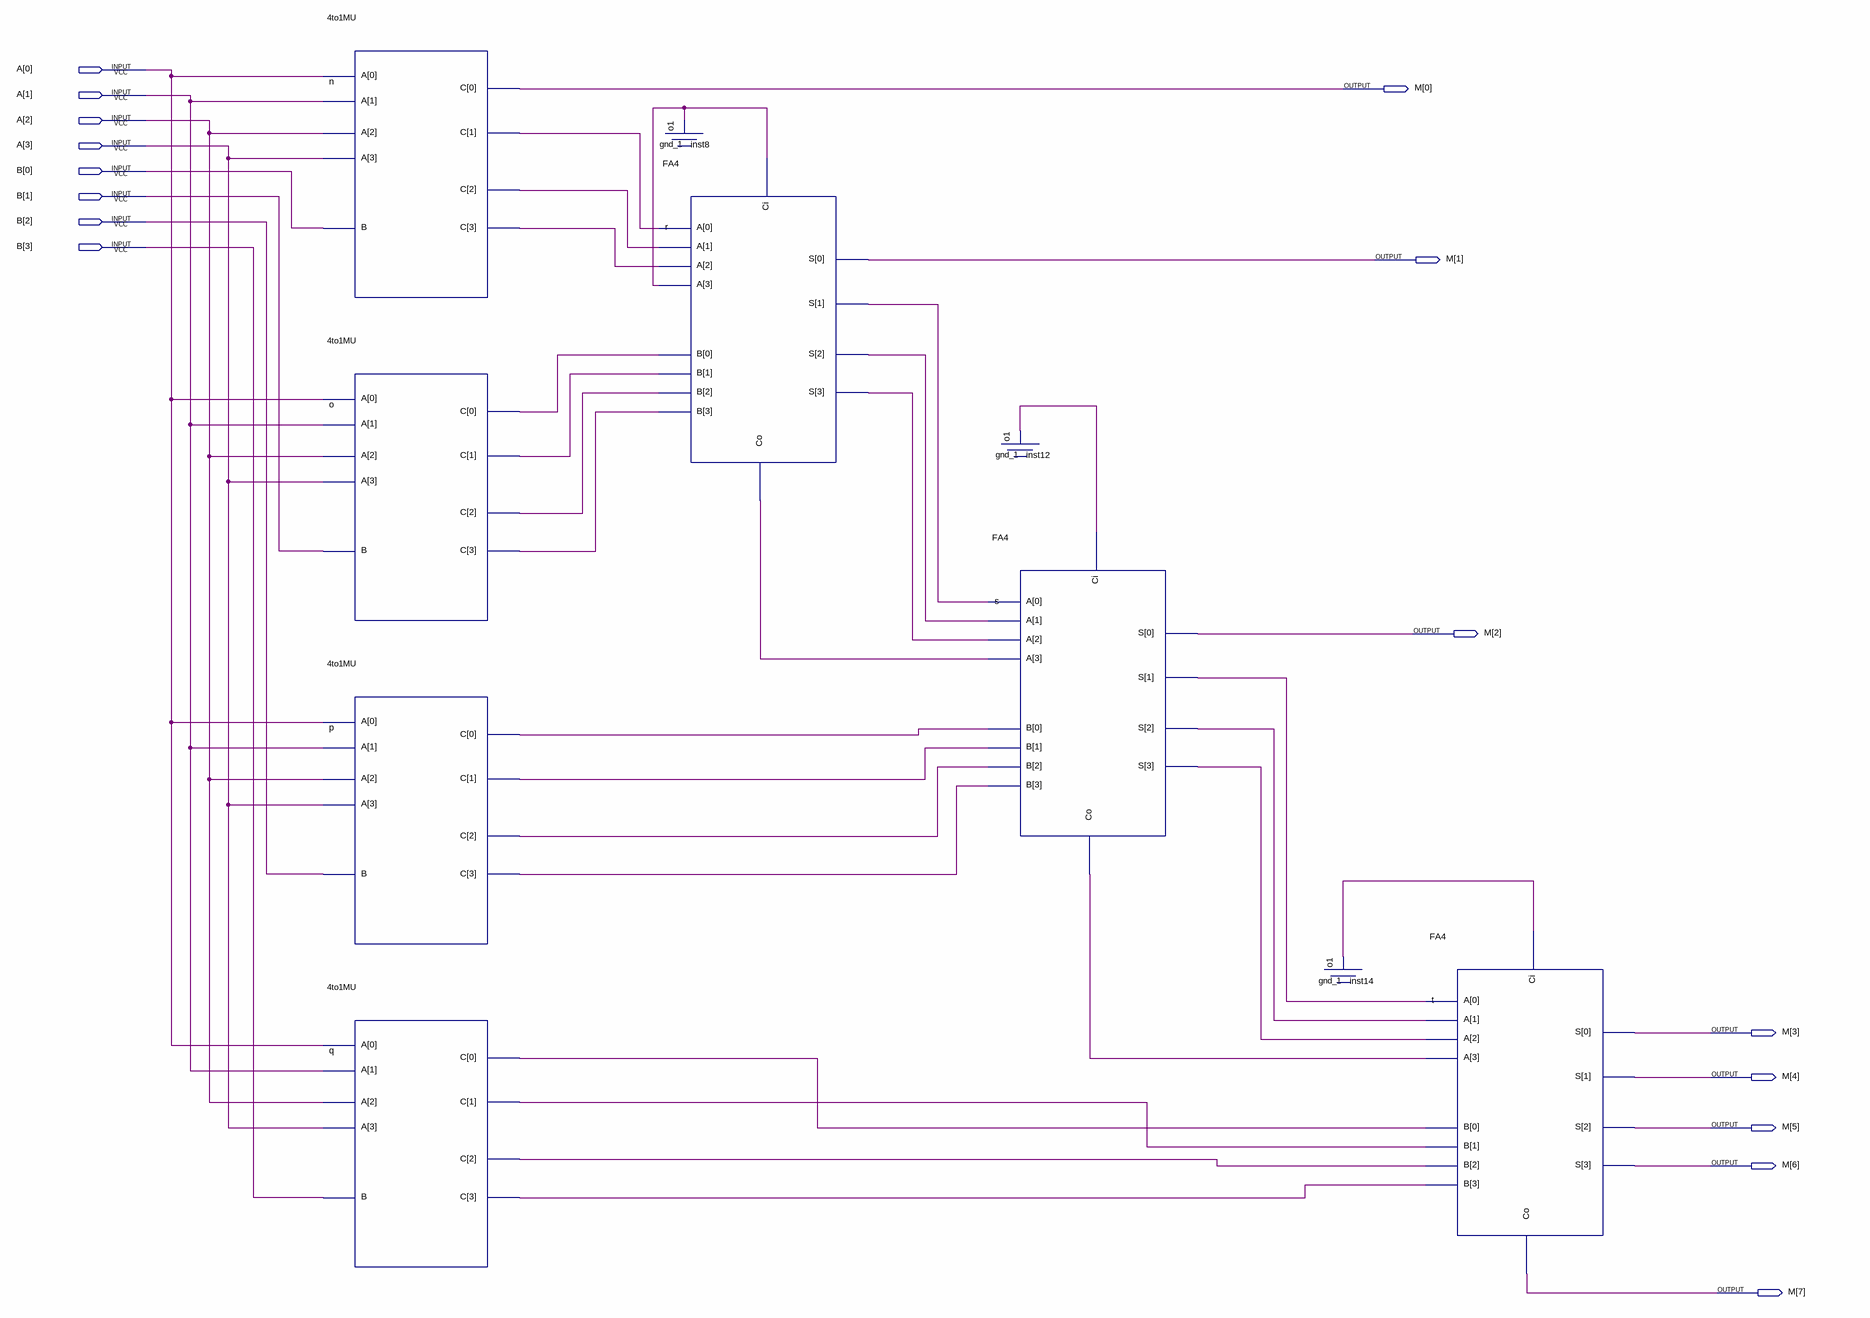
[diagram p0: schematic sheet]
// Quartus schematic MU4.bdf as structural Verilog: 10 symbols, 16 pins
module MU4 (
  input  [3:0] A,
  input  [3:0] B,
  output [7:0] M
);

  wire inst8_o1, inst12_o1, inst14_o1, n_c, n_c_2, n_c_3, o_c, o_c_2, o_c_3, o_c_4, p_c, p_c_2, p_c_3, p_c_4,
       q_c, q_c_2, q_c_3, q_c_4, r_co, r_s, r_s_2, r_s_3, s_co, s_s, s_s_2, s_s_3;

  \4to1MU  n (.A(A), .B(B[0]), .C({n_c_3, n_c_2, n_c, M[0]}));
  \4to1MU  o (.A(A), .B(B[1]), .C({o_c_4, o_c_3, o_c_2, o_c}));
  \4to1MU  p (.A(A), .B(B[2]), .C({p_c_4, p_c_3, p_c_2, p_c}));
  \4to1MU  q (.A(A), .B(B[3]), .C({q_c_3, q_c_2, q_c, q_c_4}));
  gnd_1 inst8 (.o1(inst8_o1));
  FA4 r (
    .A({inst8_o1, n_c_3, n_c_2, n_c}), .B({o_c_4, o_c_3, o_c_2, o_c}), .Ci(inst8_o1), .Co(r_co),
    .S({r_s_3, r_s_2, r_s, M[1]}));
  gnd_1 inst12 (.o1(inst12_o1));
  FA4 s (
    .A({r_co, r_s_3, r_s_2, r_s}), .B({p_c_4, p_c_3, p_c_2, p_c}), .Ci(inst12_o1), .Co(s_co),
    .S({s_s, s_s_2, s_s_3, M[2]}));
  gnd_1 inst14 (.o1(inst14_o1));
  FA4 t (.A({s_co, s_s, s_s_2, s_s_3}), .B({q_c_3, q_c_2, q_c, q_c_4}), .Ci(inst14_o1), .Co(M[7]), .S(M[6:3]));
endmodule
